# EasyEDA schematic 8086- Project.json
TITLE: Unitatea Centrala; REV: 1.0; Date: 2024-11-20; Sheet: 1/1; Drawn By: Vlad Purza; Company: Your Company
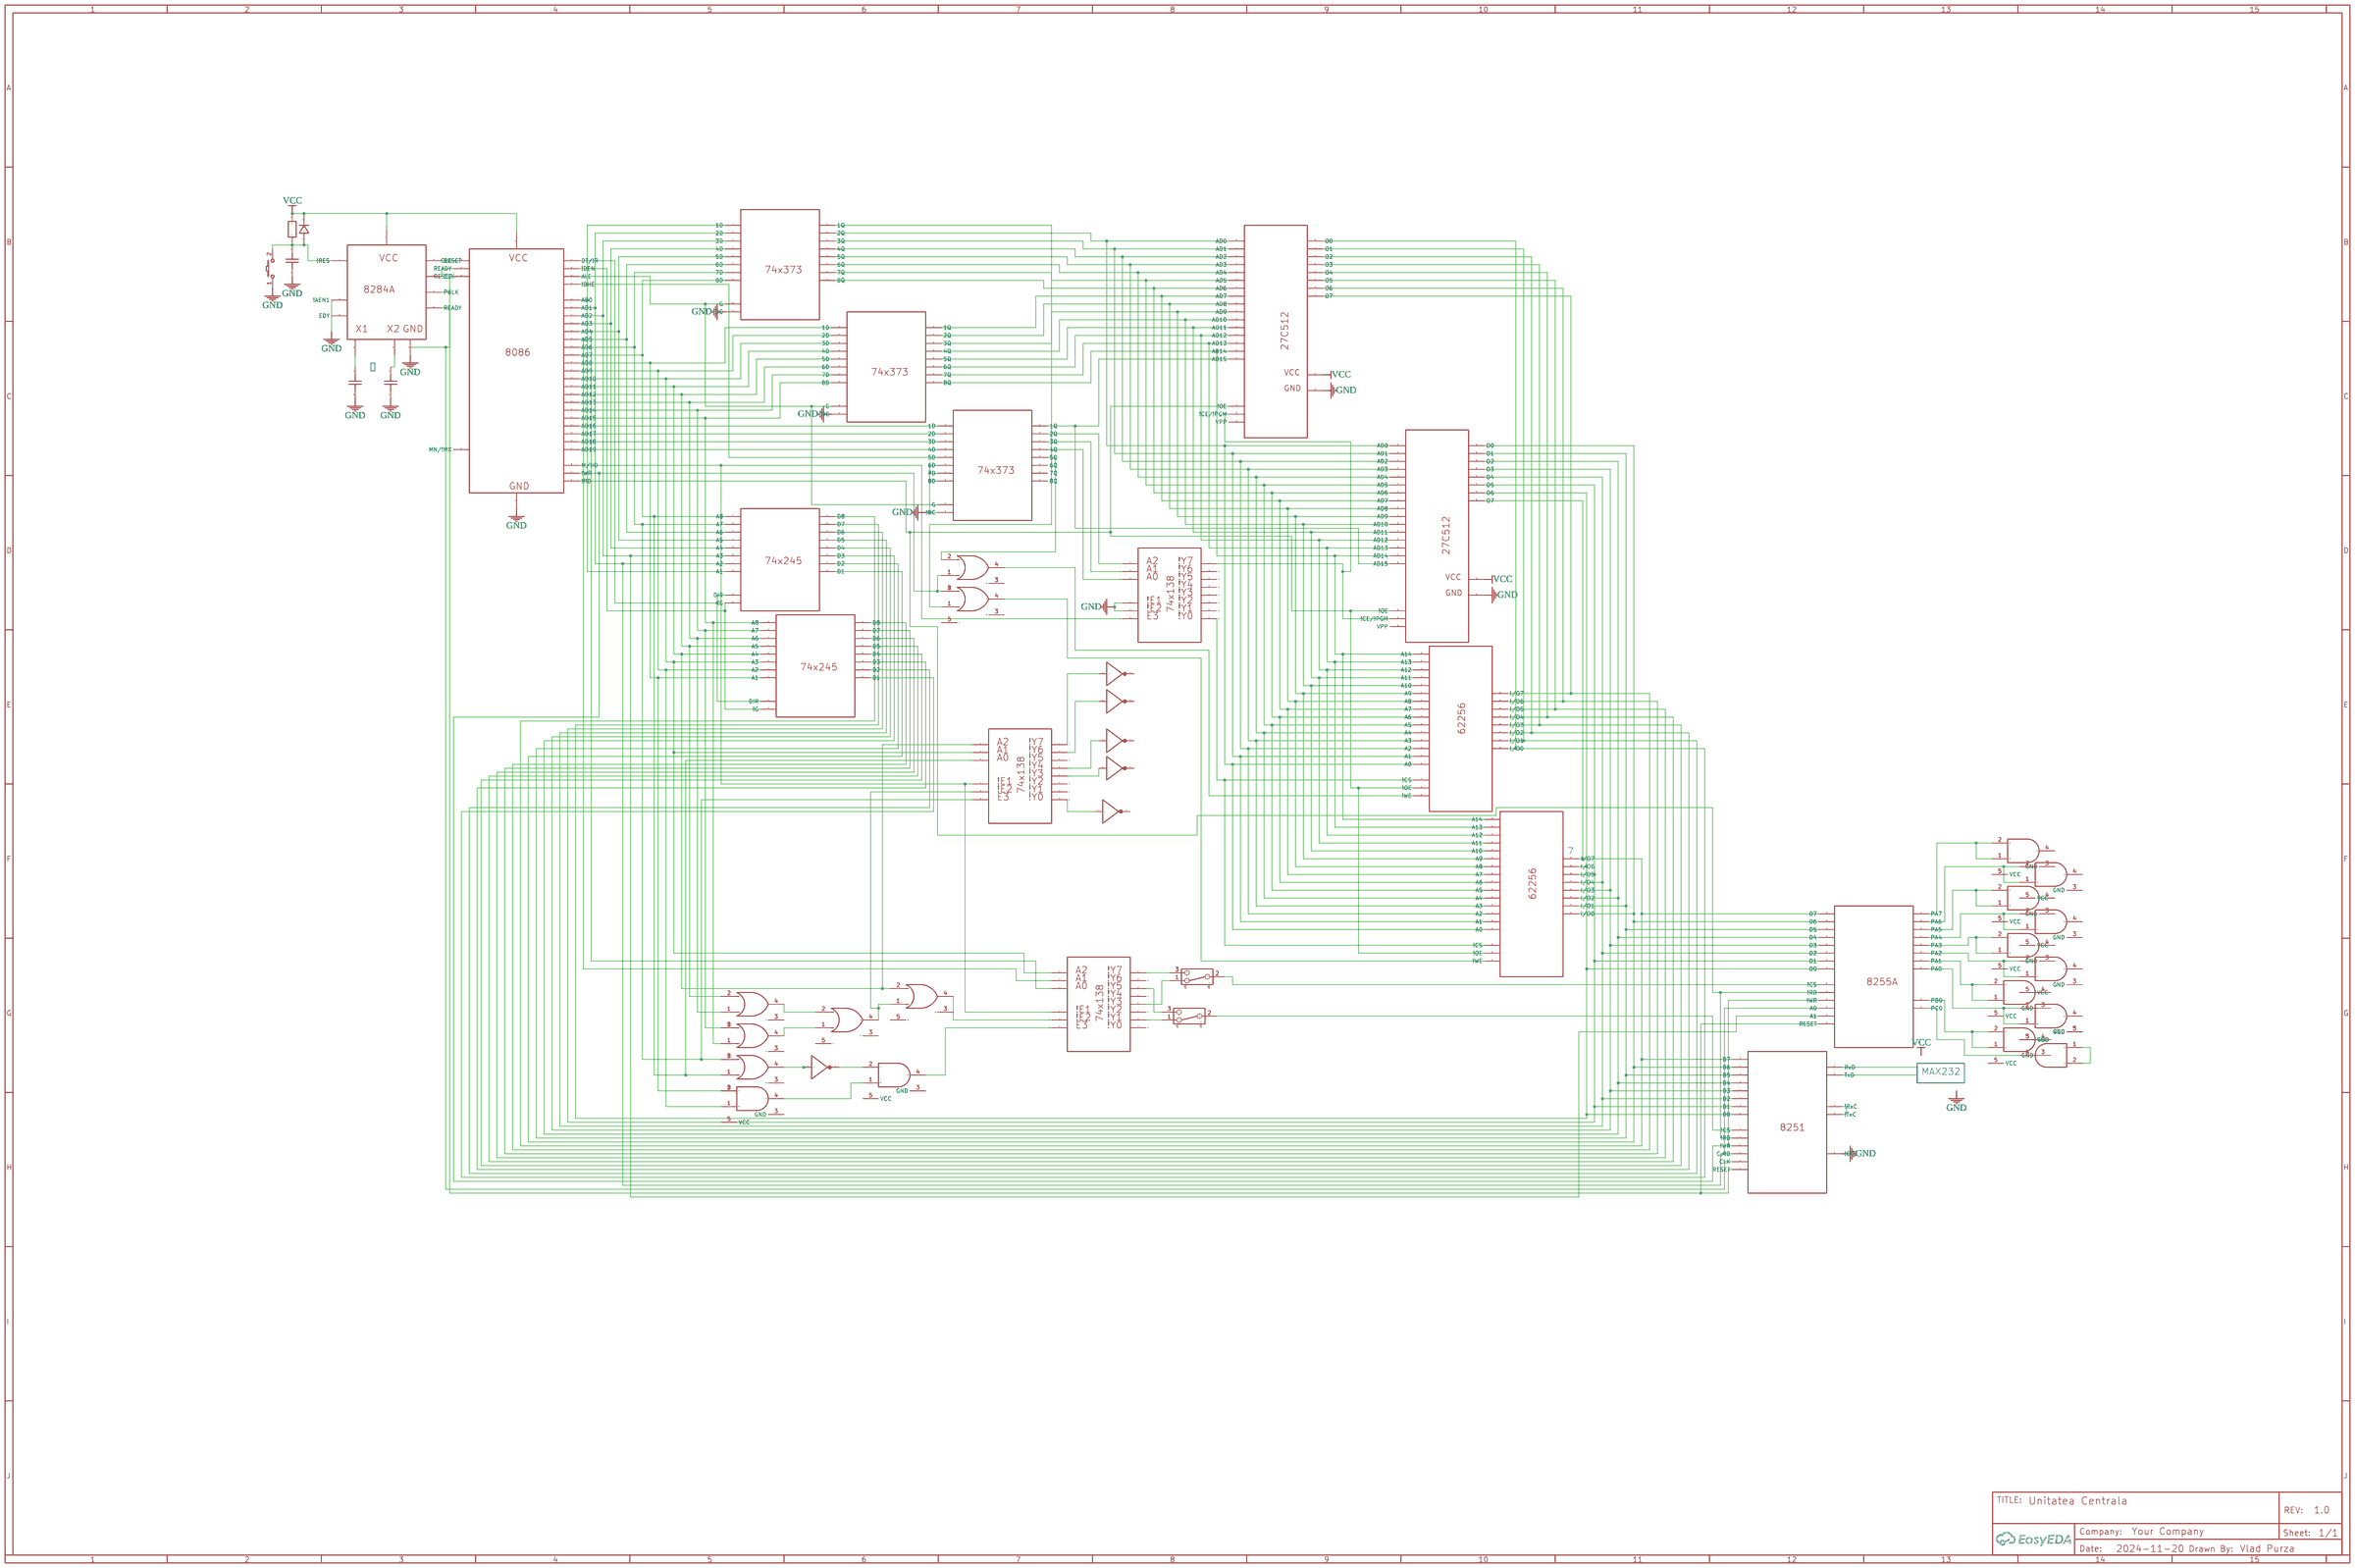
[diagram p0: schematic sheet]

## Parts
C1  0.1u  [C0603]
C2  0.1u  [C0805]
C3  0.1u  [C0805]
D1  1N4007W  [SOD-123_L2.8-W1.8-LS3.7-RD]
KEY1  K2-3.6×6.1_SMD  [KEY-SMD_2P-L6.2-W3.6-LS8.0]
R1  1k  [R0603]
SW1  SK-12D02-VG5  [SW-TH_SK-12D02VG3]
SW2  SK-12D02-VG5  [SW-TH_SK-12D02VG3]
U1  8086
U2  74x373
U3  74x245
U4  74x245
U5  8284A
U6  27C512
U7  27C512
U8  74x373
U9  74x373
U10  74x138
U11  MC74VHC1G32DFT1  [SOT353]
U12  MC74VHC1G32DFT1  [SOT353]
U13  62256
U14  62256
U15  74x138
U16  74x138
U17  HD74ALVC1G08VS  [PUSN0005KA-A]
U18  HD74ALVC1G08VS  [PUSN0005KA-A]
U19  MC74VHC1G32DFT1  [SOT353]
U20  MC74VHC1G32DFT1  [SOT353]
U21  MC74VHC1G32DFT1  [SOT353]
U22  MC74VHC1G32DFT1  [SOT353]
U23  MC74VHC1G32DFT1  [SOT353]
U24  NOT Gate  [NOT_GATE]
U25  NOT Gate  [NOT_GATE]
U26  NOT Gate  [NOT_GATE]
U27  NOT Gate  [NOT_GATE]
U28  NOT Gate  [NOT_GATE]
U29  NOT Gate  [NOT_GATE]
U30  8251
U31  8255A
U32  HD74ALVC1G08VS  [PUSN0005KA-A]
U33  HD74ALVC1G08VS  [PUSN0005KA-A]
U34  HD74ALVC1G08VS  [PUSN0005KA-A]
U35  HD74ALVC1G08VS  [PUSN0005KA-A]
U36  HD74ALVC1G08VS  [PUSN0005KA-A]
U37  HD74ALVC1G08VS  [PUSN0005KA-A]
U38  HD74ALVC1G08VS  [PUSN0005KA-A]
U39  HD74ALVC1G08VS  [PUSN0005KA-A]
U40  HD74ALVC1G08VS  [PUSN0005KA-A]
U41  HD74ALVC1G08VS  [PUSN0005KA-A]

## Library data of the parts
C1 = C_0603_US: Contributor: LCEDA_Lib
C2 C3 = C_0805_US: Contributor: LCEDA_Lib
D1 = 1N4007W: Supplier: LCSC; Supplier Part: C328592; Manufacturer: BLUE ROCKET; Contributor: LCEDA_Lib
KEY1 = K2-3.6×6.1_SMD: Supplier Part: C118141; Supplier: LCSC; Manufacturer Part: K2-1107ST-A4SW-06; Contributor: LCEDA_Lib; 制造商: 韩国韩荣
R1 = R_0603_EU: Contributor: LCEDA_Lib
SW1 SW2 = SK-12D02-VG5: Supplier: LCSC; Supplier Part: C136722; Manufacturer: Rectangular Connectors - Contacts; Contributor: LCSC
U1 = 8086: Contributor: Guest
U2 U8 U9 = 74x373: Contributor: Guest
U3 U4 = 74x245: Contributor: vpurza
U5 = 8284A: Contributor: vpurza
U6 U7 = 27C512: Contributor: vpurza
U10 U15 U16 = 74x138: Contributor: vpurza
U11 U12 U19-U23 = MC74VHC1G32DFT1: 2-Input OR Gate
U13 U14 = 62256: Contributor: Guest
U17 U18 U32-U41 = HD74ALVC1G08VS: 2-Input AND Gate
U24-U29 = NOT Gate: Contributor: Giann De Leon
U30 = 8251: Contributor: vpurza
U31 = 8255A: Contributor: vpurza

## Nets
GND: C1.2 C2.2 C3.2 KEY1.1
VCC: D1.1 R1.2
Net-(C1-1): C1.1 D1.2 KEY1.2 R1.1
Net-(U11-2): U11.2(IN A) U12.1(IN B) U12.5(VDD)
Net-(U17-1): U17.1(IN B) U18.4(OUT Y)
Net-(U17-2): U17.2(IN A) U24.2(OUT)
Net-(U18-2): U18.2(IN A) U19.5(VDD)
Net-(U19-2): U19.2(IN A) U20.5(VDD)
Net-(U19-4): U19.4(Y) U24.1(IN)
Net-(U20-2): U20.2(IN A) U21.5(VDD)
Net-(U20-4): U20.4(Y) U22.1(IN B)
Net-(U21-4): U21.4(Y) U22.2(IN A)
Net-(U22-4): U22.4(Y) U23.1(IN B)
Net-(U32-1): U32.1(IN B) U32.2(IN A)
Net-(U33-1): U33.1(IN B) U33.2(IN A)
Net-(U34-1): U34.1(IN B) U34.2(IN A)
Net-(U35-1): U35.1(IN B) U35.2(IN A)
Net-(U36-1): U36.1(IN B) U36.2(IN A)
Net-(U37-1): U37.1(IN B) U37.2(IN A)
Net-(U38-1): U38.1(IN B) U38.2(IN A)
Net-(U39-1): U39.1(IN B) U39.2(IN A)
Net-(U39-3): U39.3(GND) U41.5(VCC)
Net-(U39-5): U39.5(VCC) U41.3(GND)
Net-(U40-1): U40.1(IN B) U40.2(IN A)
Net-(U41-1): U41.1(IN B) U41.2(IN A)

Not connected (* = marked no-connect by the designer): C2 1; C3 1; SW1 1 2 3 4 5; SW2 1 2 3 4 5; U1 0(AD0) 1(AD1) 2(AD2) 3(AD3) 4(AD4) 5(AD5) 6(AD6) 7(AD7) 8(AD8) 9(AD9) 10(AD10) 11(AD11) 12(AD12) 13(AD13) 14(AD14) 15(AD15) 16(AD16) 17(AD17) 18(AD18) 19(AD19) 20(DT/!R) 21(!DEN) 22(ALE) 23(!BHE) 24(CLK) 25(READY) 26(RESET) 27(MN/!MX) 28(M/!IO) 29(!WR) 30(!RD) 31(20) 32(21); U2 1(1D) 2(2D) 3(3D) 4(4D) 5(5D) 6(6D) 7(7D) 8(8D) 9(1Q) 10(2Q) 11(3Q) 12(4Q) 13(6Q) 14(7Q) 15(8Q) 16(5Q) 20(G) 21(!OC); U3 1(A8) 2(A7) 3(A6) 4(A5) 5(A4) 6(A3) 7(A2) 8(A1) 9(D8) 10(D7) 11(D6) 12(D5) 13(D3) 14(D2) 15(D1) 16(D4) 20(DIR) 21(!G); U4 1(A8) 2(A7) 3(A6) 4(A5) 5(A4) 6(A3) 7(A2) 8(A1) 9(D8) 10(D7) 11(D6) 12(D5) 13(D3) 14(D2) 15(D1) 16(D4) 20(DIR) 21(!G); U5 0(RESET) 1(CLK) 2(PCLK) 3(READY) 4(!RES) 5(!AEN1) 6(EDY) 7(2) 8(3) 9(4) 10(5); U6 0(AD0) 1(AD1) 2(AD2) 3(AD3) 4(AD4) 5(AD5) 6(AD6) 7(AD7) 8(AD8) 9(AD9) 10(AD10) 11(AD11) 12(AD12) 13(AD13) 14(AD14) 31(20) 32(21) 50(O0) 51(O1) 52(O2) 53(O3) 54(O4) 55(O5) 56(O6) 57(O7) 60(VPP) 61(!CE/!PGM) 62(!OE) 63(AD15); U7 0(AD0) 1(AD1) 2(AD2) 3(AD3) 4(AD4) 5(AD5) 6(AD6) 7(AD7) 8(AD8) 9(AD9) 10(AD10) 11(AD11) 12(AD12) 13(AD13) 14(AD14) 31(20) 32(21) 50(O0) 51(O1) 52(O2) 53(O3) 54(O4) 55(O5) 56(O6) 57(O7) 60(VPP) 61(!CE/!PGM) 62(!OE) 63(AD15); U8 1(1D) 2(2D) 3(3D) 4(4D) 5(5D) 6(6D) 7(7D) 8(8D) 9(1Q) 10(2Q) 11(3Q) 12(4Q) 13(6Q) 14(7Q) 15(8Q) 16(5Q) 20(G) 21(!OC); U9 1(1D) 2(2D) 3(3D) 4(4D) 5(5D) 6(6D) 7(7D) 8(8D) 9(1Q) 10(2Q) 11(3Q) 12(4Q) 13(6Q) 14(7Q) 15(8Q) 16(5Q) 20(G) 21(!OC); U10 1 2 3 4 5 6 7 8 9 10 11 12 13 14; U11 1(IN B) 3(GND) 4(Y) 5(VDD); U12 2(IN A) 3(GND) 4(Y); U13 15(A0) 16(A1) 17(A2) 18(A3) 19(A4) 20(A5) 21(A6) 22(A7) 23(A8) 24(A9) 25(A10) 26(A11) 27(A12) 28(A13) 29(A14) 30(!CS) 31(!OE) 32(!WE) 33(I/O0) 34(I/O1) 35(I/O2) 36(I/O3) 37(I/O4) 38(I/O5) 39(I/O6) 40(I/O7); U14 15(A0) 16(A1) 17(A2) 18(A3) 19(A4) 20(A5) 21(A6) 22(A7) 23(A8) 24(A9) 25(A10) 26(A11) 27(A12) 28(A13) 29(A14) 30(!CS) 31(!OE) 32(!WE) 33(I/O0) 34(I/O1) 35(I/O2) 36(I/O3) 37(I/O4) 38(I/O5) 39(I/O6) 40(I/O7); U15 1 2 3 4 5 6 7 8 9 10 11 12 13 14; U16 1 2 3 4 5 6 7 8 9 10 11 12 13 14; U17 3(GND) 4(OUT Y) 5(VCC); U18 1(IN B) 3(GND) 5(VCC); U19 1(IN B) 3(GND); U20 1(IN B) 3(GND); U21 1(IN B) 2(IN A) 3(GND); U22 3(GND) 5(VDD); U23 2(IN A) 3(GND) 4(Y) 5(VDD); U25 1(IN) 2(OUT); U26 1(IN) 2(OUT); U27 1(IN) 2(OUT); U28 1(IN) 2(OUT); U29 1(IN) 2(OUT); U30 9(D0) 10(D7) 11(D6) 12(D5) 13(D3) 14(D2) 15(D1) 16(D4) 20(!CS) 21(!RD) 22(RxD) 23(TxD) 24(!RxC) 25(!TxC) 26(!CTS) 30(!WR) 31(C/!D) 32(CLK) 33(RESET); U31 9(D0) 10(D7) 11(D6) 12(D5) 13(D3) 14(D2) 15(D1) 16(D4) 19(PA7) 20(!CS) 21(PA6) 22(PA5) 23(PA4) 24(PA3) 25(PA2) 26(PA1) 27(PA0) 30(!RD) 31(A0) 32(A1) 33(RESET) 39(!WR) 40(PB0) 41(PC0); U32 3(GND) 4(OUT Y) 5(VCC); U33 3(GND) 4(OUT Y) 5(VCC); U34 3(GND) 4(OUT Y) 5(VCC); U35 3(GND) 4(OUT Y) 5(VCC); U36 3(GND) 4(OUT Y) 5(VCC); U37 3(GND) 4(OUT Y) 5(VCC); U38 3(GND) 4(OUT Y) 5(VCC); U39 4(OUT Y); U40 3(GND) 4(OUT Y) 5(VCC); U41 4(OUT Y)

## Notes on the sheet
- 7
- MAX232
